# Altium project PlacasBeetle.PrjPcb
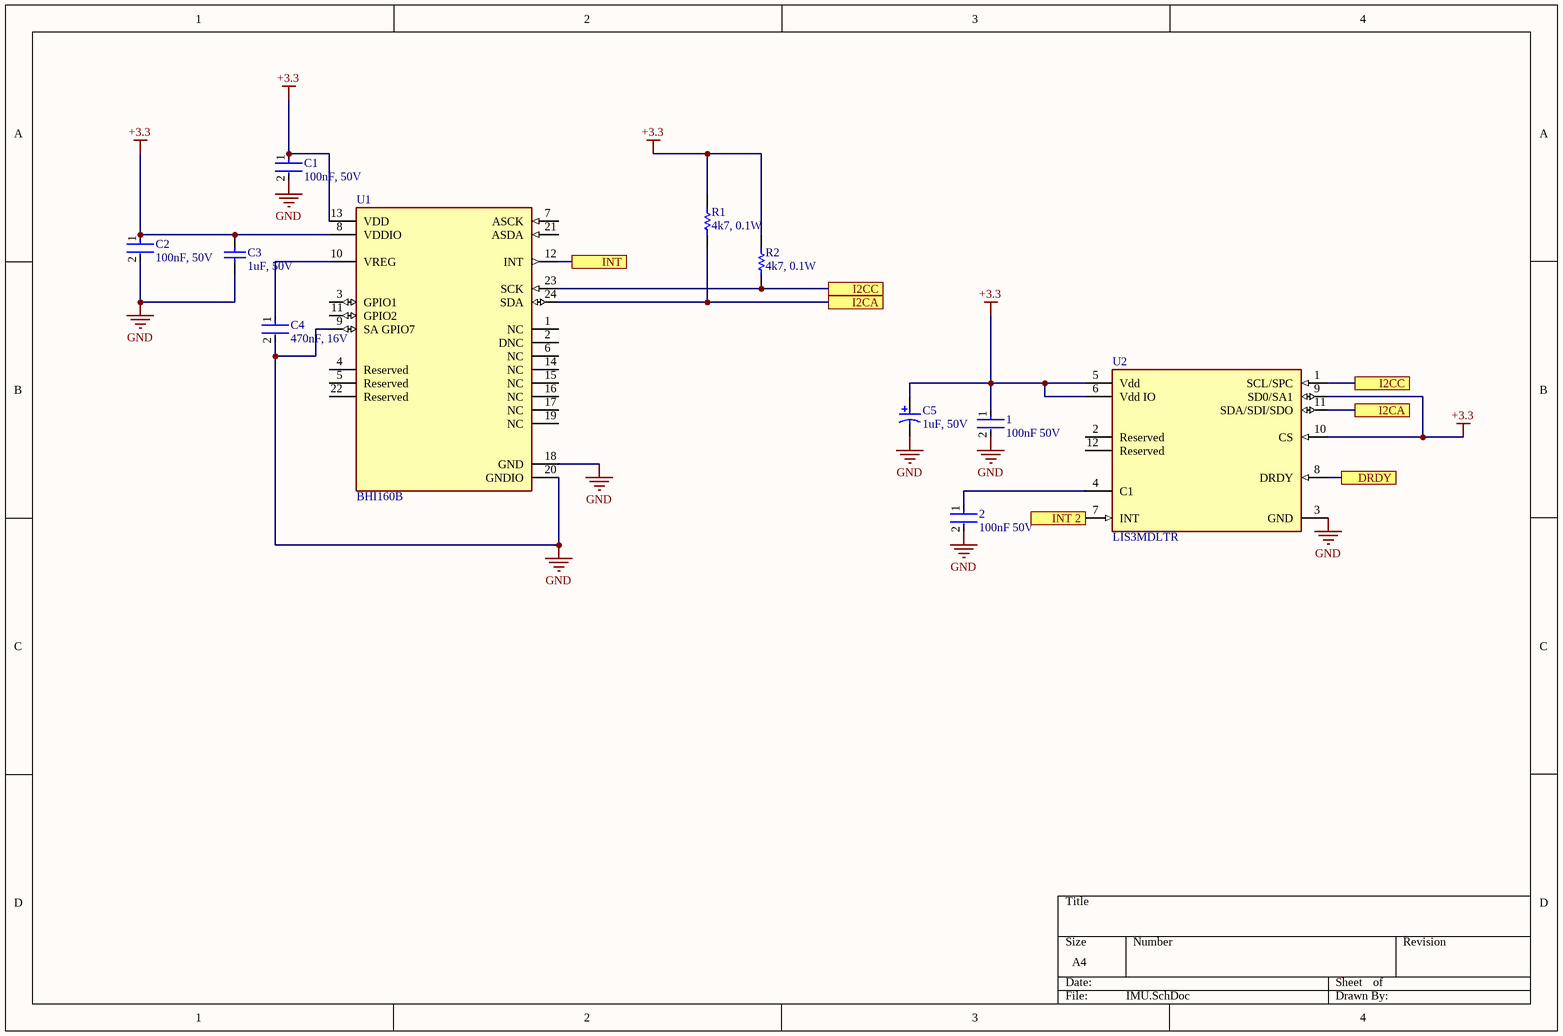
[diagram p0: IMU.SchDoc]
2 sheets, 32 parts. Net scope: flat (ports and power ports of the same name join across sheets).
Board file: PlacaMãe.PcbDoc
Sheets:
  IMU.SchDoc
  PlacaMãe_Raw.SchDoc

## Sheet IMU.SchDoc
size A4; SheetNumber: 1; SheetTotal: 2

### Parts
1  100nF 50V  [FP-CGA3E-0_3-0_1-IPC_A]
2  100nF 50V  [FP-CGA3E-0_3-0_1-IPC_A]
C1  100nF, 50V  [FP-CGA3E-0_3-0_1-IPC_A]
C2  100nF, 50V  [FP-CGA3E-0_3-0_1-IPC_A]
C3  1uF, 50V  [CAPC1608X90X35ML10T25]
C4  470nF, 16V  [FP-C0603C-CF-MFG]
C5  1uF, 50V  [CAPPR55-200-1100X500X1200]
R1  4k7, 0.1W  [RESC1608X55X25LL10T15]
R2  4k7, 0.1W  [RESC1608X55X25LL10T15]
U1  BHI160B  [FP-BHI160B-MFG]
U2  LIS3MDLTR  [FP-VFLGA-12-8365767-MFG]

### Ports
DRDY, I2CA, I2CC, INT, INT 2

### Nets
+3.3: 1.1 C1.1 C2.1 C3.2 C5.1 R1.2 R2.2 U1.8(VDDIO) U1.13(VDD) U2.5(Vdd) U2.6(Vdd_IO) U2.9(SD0/SA1) U2.10(CS)
GND: 1.2 2.2 C1.2 C2.2 C3.1 C4.2 C5.2 U1.9(SA_GPIO7) U1.18(GND) U1.20(GNDIO) U2.3(GND)
Net2_1: 2.1 U2.4(C1)
NetC4_1: C4.1 U1.10(VREG)
NetP1_15: R2.1 U1.23(SCK) U2.1(SCL/SPC) ; port I2CC
NetP1_16: R1.1 U1.24(SDA) U2.11(SDA/SDI/SDO) ; port I2CA
NetP2_2: U2.7(INT) ; port INT 2
NetP2_3: U2.8(DRDY) ; port DRDY
NetP2_11: U1.12(INT) ; port INT

Not connected (* = marked no-connect by the designer): U1 1(NC) 2(DNC) 3(GPIO1) 4(Reserved) 5(Reserved) 6(NC) 7(ASCK) 11(GPIO2) 14(NC) 15(NC) 16(NC) 17(NC) 19(NC) 21(ASDA) 22(Reserved); U2 2(Reserved) 12(Reserved)

### Library data of the parts
1 2 C1 C2 = CMP-2000-07546-2: Cap Ceramic 100nF 50V X7R 10% Pad SMD 0603 +125°C Automotive T/R; Weight: 7.1E-05oz; Composition: Ceramic; Max Operating Temperature: 125°C; Termination: SMD/SMT; Dielectric: X7R; Length: 1.6mm; Package Quantity: 1; REACH SVHC: No SVHC; Lead Free: Lead Free; Case Code (Metric): 1608; Min Operating Temperature: -55°C; Packaging: Tape and Reel; Tolerance: 10%; Voltage Rating: 50V; Case Code (Imperial): 0603; Capacitance: 100nF; Case/Package: 0603; Voltage Rating (DC): 50V; Depth: 0.8mm; Radiation Hardening: No; Ratings: AEC-Q200; Mount: Surface Mount; Voltage: 50V; Thickness: 0.035inch; Width: 0.8mm; Height: 0.8mm
C3 = CMP-2000-05447-1: Chip Capacitor, 1 uF, +/- 10%, 50 V, -55 to 85 degC, 0603 (1608 Metric), RoHS, Tape and Reel; Manufacturer: Taiyo Yuden; Other Names: 587-2400-6; Temperature Coefficient: X5R; Online Catalog: MSeries; Catalog Drawings: xMKSeries_0603_0.8; Capacitance: 1µF; Series: M; Standard Package: 1; Package Description: 2-Pin Surface Mount Device, Body 1.6 x 0.8 mm; Ratings: -; Height - Seated (Max): -; Mounting Type: SurfaceMount,MLCC; Family: CeramicCapacitors; Size / Dimension: 0.063"Lx0.031"W(1.60mmx0.80mm); Features: -; Applications: GeneralPurpose; Lead Spacing: -; Packaging: Digi-Reel; Package Reference: 603; Thickness (Max): 0.035"(0.90mm); Category: Capacitors; Operating Temperature: -55degC~85degC; Datasheet URL: https://datasheet.ciiva.com/15922/336umk107bj105ka-t-15922611.pdf; Package / Case: 0603(1608Metric); Manufacturer URL: http://www.t-yuden.com/; Lead Style: -; Tolerance: ±10%; Voltage - Rated: 50V; Datasheet Version: Mar-13
C4 = CMP-2006-03235-2: CAP CER 0.47UF 16V X7R 0603; Manufacturer Part Number: C0603C474K4RACTU; Manufacturer: KEMET; Automotive Grade: Grade 1; Value: 0.47 μF; Tolerance: 0.1; Temperature Coefficient: 30ppm/°C; Material: Ceramic; Device Class L3: Ceramic Capacitors; ComponentLink2URL: https://api.kemet.com/component-edge/download/datasheet/C0603C100J5GACAUTO.pdf; Height: 0.87mm; ComponentLink2Description: Datasheet; Device Class L2: Capacitors; Temperature Range Low: -55°C; Temperature Range High: +125°C; RoHS: TRUE; Mouser Description: 0603 C 470nF Ceramic Multilayer Capacitor, 16 V, +125degC, X7R Dielec, +/-10%; Temperature Characteristic: X7R; Digikey Description: CAP CER 0.47UF 16V X7R 0603; Lead Free: Yes; Automotive: Yes; Octopart: https://octopart.com/c0603c474k4ractu-kemet-109683; Capacitance: 0.47 μF; Package: C0603C-CF; Voltage Rating: 16 V; Device Class L1: Passive Components; Category: Cap; Temperature: -55°C to +125°C
C5 = CMP-1665-00039-1: Aluminum Electrolytic Capacitor, 1 uF, +/- 20%, 50 V, -55 to 105 degC, 2-Pin THD, RoHS, Bulk; Channels: 2; ComponentLink1Description: Manufacturer URL; ComponentLink2Description: Datasheet; ComponentLink2URL: https://datasheet.ciiva.com/7275/94060-7275472.pdf; PackageDescription: 2-Pin Radial Lead, Dia 5 mm, Body Length 11 mm; PackageReference: CAPPR55-200-1100X500X1200; Mount: Through Hole; Radiation Hardening: No; ComponentLink1URL: http://www.panasonic.com/; Min Operating Temperature: -30 degC; Package Quantity: 150; Max Operating Temperature: 70 degC; DatasheetVersion: Mar-05; RoHSCompliant: true; Packaging: Bulk
R1 R2 = CMP-2000-06942-1: Chip Resistor, 4.7 KOhm, +/- 1%, 0.1 W, -55 to 155 degC, 0603 (1608 Metric), RoHS, Tape and Reel; Manufacturer: Yageo; Power Rating: 100mW; Temperature Coefficient: 100PPM/C; Resistance: 4.7kOhms; Voltage Rating: 50V; Package Reference: 0603; Series: RC; Datasheet Version: Rev. 7, 05/2017; Packaging: Reel; Termination Style: SMD/SMT; Datasheet URL: http://www.yageo.com/documents/recent/PYu-RC_Group_51_RoHS_L_7.pdf; Manufacturer URL: http://www.yageo.com/; Package Description: 2-Pin Surface Mount Device, Body 1.6 x 0.8 mm; Case Code - mm: 1608; Case Code - in: 0603; Mounting Technology: SurfaceMount; Operating Temperature Range: -55Cto+155C; Tolerance: 1%; Product: ThickFilmResistorsGeneralPurpose
U1 = CMP-191067-000004-1: IMU ACCEL/GYRO 3-AXIS I2C 24LGA; Manufacturer: Bosch Sensortec; Accel Resolution: 16bits; Operating Supply Current: 300-800uA; Sensor Type: Temperature,Accelerometer,Gyroscope; Accel Range: 2/4/8/16g; Gyro Sensitivity: 16.4/32.8/65.6/131.2/262.4LSB/°/s; Min Supply Voltage: 1.6V; Gyro Range: 125/250/500/1000/2000°/s; Accel Sensitivity: 2048/4096/8192/16384LSB/g; Max Supply Voltage: 3.6V; Sensor Output: I2C; Lead Free: Yes; Temperature: -40°C to +85°C; Height: 1mm; Ambient Temperature Range High: +85°C; Manufacturer Part Number: BHI160B; Temperature Range Low: -40°C; Category: IC; Octopart: https://octopart.com/bhi160b-bosch+sensortec-108216126; ComponentLink2URL: https://ae-bst.resource.bosch.com/media/_tech/media/datasheets/BST-BHI160B-DS000.pdf; RoHS: TRUE; Ambient Temperature Range Low: -40°C; Digikey Description: IMU ACCEL/GYRO 3-AXIS I2C 24LGA; Device Class L1: Sensors; Temperature Range High: +85°C; ComponentLink2Description: Datasheet; Package: 0; Device Class L2: Motion Sensors; Device Class L3: Inertial Measurement Units (IMUs); Automotive: No; Resolution: 16bits
U2 = CMP-2000-07463-2: SENSOR MR I2C/SPI 12LGA; Manufacturer: STMicroelectronics; Sensor Output: I2C,SPI; Operating Supply Current: 40-270uA; Max Supply Voltage: 3.6V; Sensing Method: Magnetic; Min Supply Voltage: 1.71V; ComponentLink2URL: https://www.st.com/resource/en/datasheet/lis3mdl.pdf; Category: IC; Manufacturer Part Number: LIS3MDLTR; Octopart: https://octopart.com/lis3mdltr-stmicroelectronics-29403125; Automotive: No; ComponentLink2Description: Datasheet; RoHS: TRUE; Device Class L3: unset; Device Class L1: Sensors; Temperature: -40°C to +85°C; Height: 1mm; Mouser Description: Board Mount Hall Effect / Magnetic Sensors Ultra Lo-Pwr Hi Perf 3-Axis 1.9-3.6V; Temperature Range High: +85°C; Lead Free: Yes; Device Class L2: Magnetic Sensors; Footprint Url: https://www.st.com/content/ccc/resource/technical/document/technical_note/73/17/9c/16/dd/96/4a/01/CD00134799.pdf/files/CD00134799.pdf/jcr:content/translations/en.CD00134799.pdf; Temperature Range Low: -40°C; Package: VFLGA-12-8365767; Digikey Description: SENSOR MR I2C/SPI 12LGA

## Sheet PlacaMãe_Raw.SchDoc
size A4; SheetNumber: 2; SheetTotal: 2
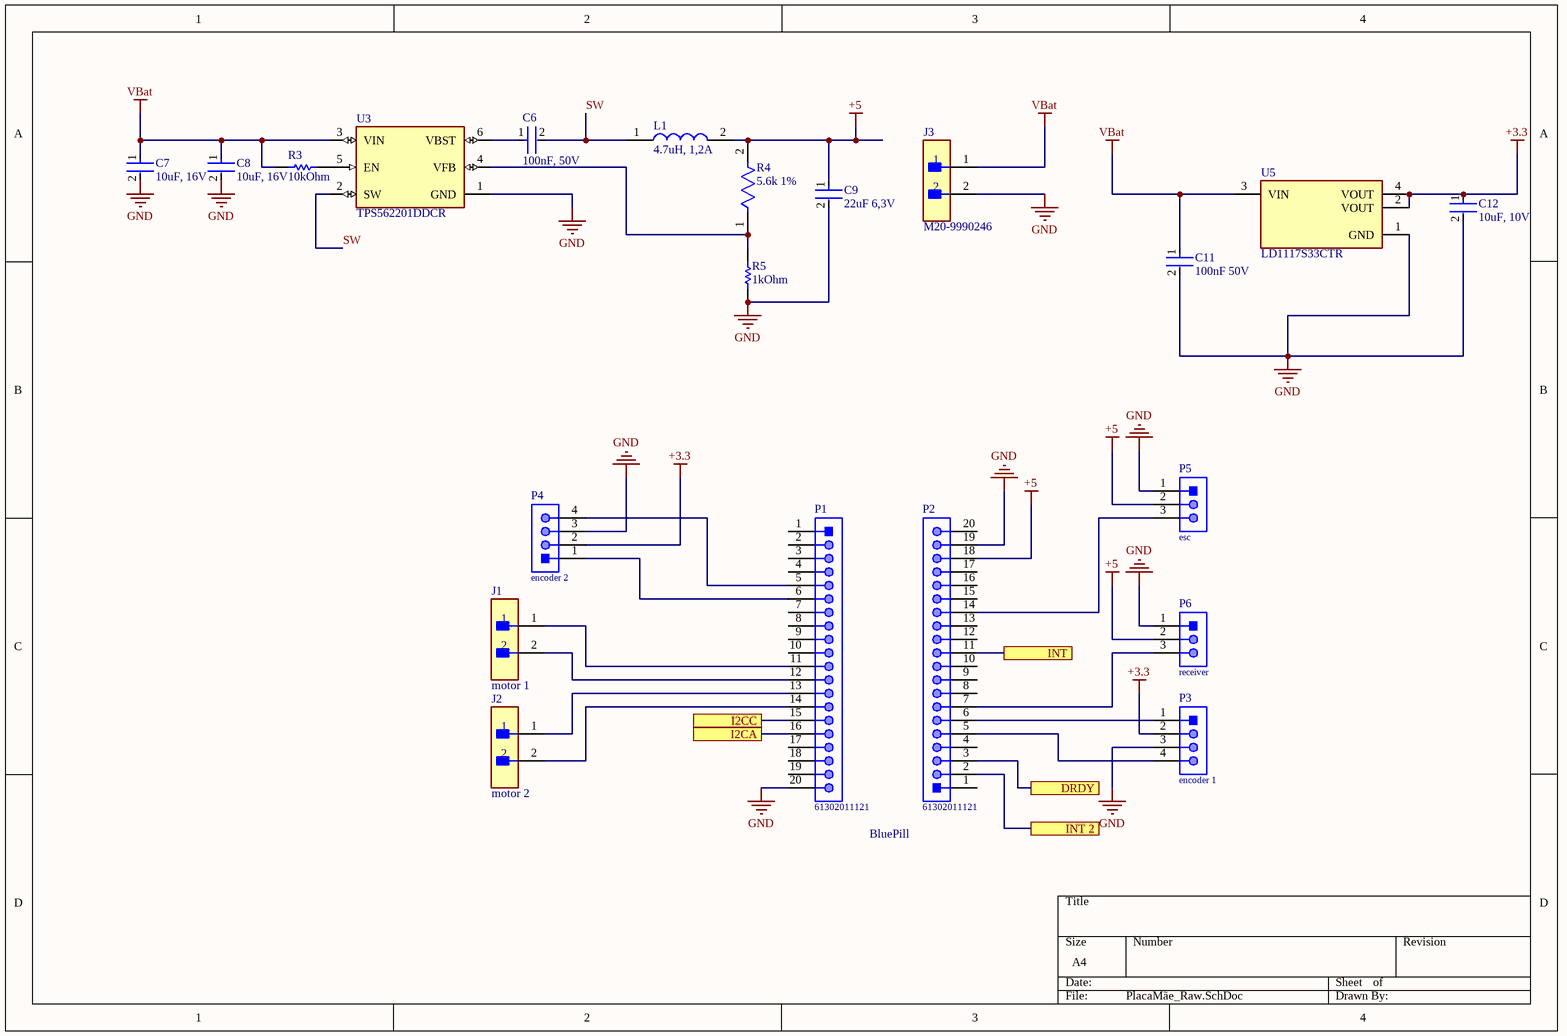
[diagram p1: PlacaMãe_Raw.SchDoc]

### Parts
C6  100nF, 50V  [FP-CGA3E-0_3-0_1-IPC_A]
C7  10uF, 16V  [FP-GRM21B-0_1-IPC_C]
C8  10uF, 16V  [FP-GRM21B-0_1-IPC_C]
C9  22uF 6,3V  [FP-GRM21B-0_15-MFG]
C11  100nF 50V  [FP-C0805C-DN-MFG]
C12  10uF, 10V  [FP-C1608-080-MFG]
J1  motor 1  [FP-M20-9990246-MFG]
J2  motor 2  [FP-M20-9990246-MFG]
J3  M20-9990246  [FP-M20-9990246-MFG]
L1  4.7uH, 1,2A  [CDRH2D09NP4R7MC]
P1  61302011121  [61302011121]
P2  61302011121  [61302011121]
P3  encoder 1  [61300411121]
P4  encoder 2  [61300411121]
P5  esc  [61300311121]
P6  receiver  [61300311121]
R3  10kOhm  [RESC1609X55X30LL15T15]
R4  5.6k 1%  [FP-CRCW0805-e3-IPC_A]
R5  1kOhm  [RESC1608X55X30ML20T20]
U3  TPS562201DDCR  [FP-DDC0006A-IPC_A]
U5  LD1117S33CTR  [FP-SOT-223-0046067_14-MFG]

### Ports
DRDY, I2CA, I2CC, INT, INT 2

### Nets
+3.3: C12.1 P3.2 P4.2 U5.2(VOUT) U5.4(VOUT)
+5: C9.1 L1.2 P2.18 P5.2 P6.2 R4.2
GND: C7.2 C8.2 C9.2 C11.2 C12.2 J3.2 P1.20 P2.19 P3.3 P4.3 P5.1 P6.1 R5.1 U3.1(GND) U5.1(GND)
VBat: C7.1 C8.1 C11.1 J3.1 R3.1 U3.3(VIN) U5.3(VIN)
SW: C6.2 L1.1 U3.2(SW)
NetC6_1: C6.1 U3.6(VBST)
NetJ1_1: J1.1 P1.11
NetJ1_2: J1.2 P1.12
NetJ2_1: J2.1 P1.13
NetJ2_2: J2.2 P1.14
NetP1_5: P1.5 P4.4
NetP1_6: P1.6 P4.1
NetP1_15: P1.15 ; port I2CC
NetP1_16: P1.16 ; port I2CA
NetP2_2: P2.2 ; port INT 2
NetP2_3: P2.3 ; port DRDY
NetP2_5: P2.5 P3.4
NetP2_6: P2.6 P3.1
NetP2_7: P2.7 P6.3
NetP2_11: P2.11 ; port INT
NetP2_14: P2.14 P5.3
NetR3_2: R3.2 U3.5(EN)
NetR4_1: R4.1 R5.2 U3.4(VFB)

Not connected (* = marked no-connect by the designer): P1 1 2 3 4 7 8 9 10 17 18 19; P2 1 4 8 9 10 12 13 15 16 17 20

### Notes on the sheet
- BluePill

### Library data of the parts
C6 = CMP-2000-07546-2: as 1 on sheet IMU; Weight: 7.1E-05oz; Composition: Ceramic; Max Operating Temperature: 125°C; Termination: SMD/SMT; Dielectric: X7R; Length: 1.6mm; Package Quantity: 1; REACH SVHC: No SVHC; Lead Free: Lead Free; Case Code (Metric): 1608; Min Operating Temperature: -55°C; Packaging: Tape and Reel; Tolerance: 10%; Voltage Rating: 50V; Case Code (Imperial): 0603; Capacitance: 100nF; Case/Package: 0603; Voltage Rating (DC): 50V; Depth: 0.8mm; Radiation Hardening: No; Ratings: AEC-Q200; Mount: Surface Mount; Voltage: 50V; Thickness: 0.035inch; Width: 0.8mm; Height: 0.8mm
C7 C8 = CMP-2007-03453-2: Chip Multilayer Ceramic Capacitors for General Purpose, 0805, 10uF, X5R, 15%, 10%, 16V; Radiation Hardening: No; Thickness: 0.053inch; Voltage Rating (DC): 16V; Lead Free: Lead Free; Package Quantity: 1; Width: 1.25mm; Case Code (Imperial): 0805; Depth: 1.25mm; Packaging: Tape and Reel; Dielectric: X5R; Max Operating Temperature: 85°C; Tolerance: 10%; Voltage Rating: 16V; Voltage: 16V; Capacitance: 10uF; Height: 1.25mm; Case Code (Metric): 2012; Material: Ceramic; Mount: Surface Mount; Case/Package: 0805; REACH SVHC: No SVHC; Length: 2mm; Min Operating Temperature: -55°C; Termination: SMD/SMT
C9 = CMP-2007-03385-2: Chip Multilayer Ceramic Capacitors for General Purpose, 0805, 22uF, X5R, 15%, 20%, 6.3V; Material: Ceramic; Max Operating Temperature: 85°C; Voltage: 6.3V; Min Operating Temperature: -55°C; Case/Package: 0805; Thickness: 0.053inch; Dielectric: X5R; Packaging: Tape and Reel; Depth: 1.25mm; Termination: SMD/SMT; Voltage Rating (DC): 6.3V; Radiation Hardening: No; Tolerance: 20%; Mount: Surface Mount; Lead Free: Lead Free; Package Quantity: 1; REACH SVHC: No SVHC; Voltage Rating: 6.3V; Capacitance: 22uF; Length: 2mm; Case Code (Imperial): 0805; Case Code (Metric): 2012; Width: 0.049inch; Height: 1.25mm
C11 = CMP-2007-00279-2: CAP CER 0.1UF 50V X7R 0805; Manufacturer Part Number: C0805C104K5RACTU; Manufacturer: KEMET; Value: 0.10 μF; Tolerance: 0.1; Temperature Coefficient: 30ppm/°C; Material: Ceramic; Device Class L2: Capacitors; Temperature Range Low: -55°C; Voltage Rating: 50 V; Digikey Description: CAP CER 0.1UF 50V X7R 0805; Category: Cap; ComponentLink2Description: Datasheet; Octopart: https://octopart.com/c0805c104k5ractu-kemet-143926; RoHS: TRUE; ComponentLink2URL: https://content.kemet.com/datasheets/KEM_C1003_C0G_SMD.pdf; Temperature Characteristic: X7R; Temperature: -55°C to +125°C; Height: 0.88mm; Temperature Range High: +125°C; Device Class L1: Passive Components; Automotive: No; Lead Free: Yes; Ipc Land Pattern Name: CAPC200125X78; Device Class L3: Ceramic Capacitors; Mouser Description: Cap Ceramic 0.1uF 50V X7R 10% SMD 2.0 x 1.2 mm 125 C Paper T/R; Capacitance: 0.10 μF; Package: C0805C-DN
C12 = CMP-2000-04979-2: CAP CER 10UF 10V X5R 0603; Manufacturer Part Number: C1608X5R1A106K080AC; Manufacturer: TDK; Temperature Coefficient: 15%; Tolerance: 10%; Material: Ceramic; Mouser Description: CAP CER 10UF 10V X5R 0603; Package: C1608-080; Lead Free: Yes; Device Class L1: Passive Components; Value: 10uF; Temperature Range High: +85°C; Octopart: https://octopart.com/c1608x5r1a106k080ac-tdk-26013468; Voltage: 10V; Footprint Url: https://product.tdk.com/info/en/catalog/spec/mlccspec_commercial_general_midvoltage_en.pdf; Ipc Land Pattern Name: CAPC16080X80; Temperature Range Low: -55°C; Temperature: -55°C to +85°C; ComponentLink2Description: Datasheet; ComponentLink2URL: https://product.tdk.com/info/en/documents/chara_sheet/C1608X5R1A106K080AC.pdf; Height: 0.9mm; Temperature Characteristic: X5R; RoHS: TRUE; Category: Cap; Capacitance: 10uF; Digikey Description: CAP CER 10UF 10V X5R 0603; Automotive: No; Device Class L3: Ceramic Capacitors; Device Class L2: Capacitors; Voltage Rating: 10V
J1 J2 = CMP-15831-000009-1: CONN HEADER VERT 2POS 2.54MM; Manufacturer: Harwin; Manufacturer Part Number: M20-9990246; Conn Gender: Male; Conn Orientation: Vertical; Number Of Contacts: 2; Current Rating: 3A; ComponentLink2URL: https://cdn.harwin.com/pdfs/M20-999.pdf; ComponentLink2Description: Datasheet; Package: M20-9990246; Temperature: -40°C to +105°C; Octopart: https://octopart.com/m20-9990246-harwin-2590635; Mouser Description: 2.54mm (0.1") Pitch SIL Vertical PC Tail Pin Header, 6.1mm mating pin height, tin, 2 contacts; Temperature Range High: +105°C; Device Class L1: Connectors; RoHS: TRUE; Automotive: No; Height: 8.99mm; Number Of Rows: 1; Contact Material: Tin,Nickel; Category: Conn; Pitch: 2.54mm; Lead Free: Yes; Digikey Description: CONN HEADER VERT 2POS 2.54MM; Temperature Range Low: -40°C; Device Class L3: unset; Device Class L2: Headers and Wire Housings
J3 = CMP-15831-000009-1: CONN HEADER VERT 2POS 2.54MM; Manufacturer: Harwin; Conn Gender: Male; Conn Orientation: Vertical; Number Of Contacts: 2; Current Rating: 3A; ComponentLink2URL: https://cdn.harwin.com/pdfs/M20-999.pdf; ComponentLink2Description: Datasheet; Package: M20-9990246; Temperature: -40°C to +105°C; Octopart: https://octopart.com/m20-9990246-harwin-2590635; Mouser Description: 2.54mm (0.1") Pitch SIL Vertical PC Tail Pin Header, 6.1mm mating pin height, tin, 2 contacts; Temperature Range High: +105°C; Device Class L1: Connectors; RoHS: TRUE; Automotive: No; Height: 8.99mm; Number Of Rows: 1; Contact Material: Tin,Nickel; Category: Conn; Pitch: 2.54mm; Lead Free: Yes; Digikey Description: CONN HEADER VERT 2POS 2.54MM; Manufacturer Part Number: M20-9990246; Temperature Range Low: -40°C; Device Class L3: unset; Device Class L2: Headers and Wire Housings
L1 = CDRH2D18_HPNP-4R7NC: Inductor; Manufacturer_Name: Sumida; Manufacturer_Part_Number: CDRH2D18/HPNP-4R7NC; Datasheet Link: https://products.sumida.com/products/pdf/CDRH2D18HP.pdf; Height: 1mm; Mouser Part Number: 851-CDRH2D18HP-4R7NC; Mouser Price/Stock: https://www.mouser.co.uk/ProductDetail/Sumida/CDRH2D18-HPNP-4R7NC?qs=%2Fk4tzQy0az%2FNmO92%2F%252BEfMw%3D%3D; Arrow Part Number: CDRH2D18/HPNP-4R7NC; Arrow Price/Stock: https://www.arrow.com/en/products/cdrh2d18hpnp-4r7nc/sumida
P1 P2 = CMP-1502-01102-1: THT Vertical Pin Header WR-PHD, Pitch 2.54 mm, Single Row, 20 pins; Manufacturer: Wurth Elektronik; Withstanding Voltage: 500VAC; Gender: Male; Pin Number: 20; Rated Current: 3A; Contact Resistance: 20mOhm; Pitch: 2.54mm; Working Voltage: 250VAC; Publisher: WurthElektronik; Packaging: Bag; Datasheet URL: https://katalog.we-online.de/em/datasheet/6130xx11121.pdf; Row Number: Single; Mounting Technology: THT; Manufacturer URL: http://www.we-online.de; Orientation: Vertical; Package Reference: 61302011121; Part Number: 61302011121; Operating Temperature: -40to105degC
P3 P4 = CMP-1502-01064-1: THT Vertical Pin Header WR-PHD, Pitch 2.54 mm, Single Row, 4 pins; Manufacturer: Wurth Elektronik; Withstanding Voltage: 500VAC; Rated Current: 3A; Working Voltage: 250VAC; Pin Number: 4; Gender: Male; Contact Resistance: 20mOhm; Pitch: 2.54mm; Manufacturer URL: http://www.we-online.de; Operating Temperature: -40to105degC; Packaging: Bag; Mounting Technology: THT; Package Reference: 61300411121; Datasheet URL: https://katalog.we-online.de/em/datasheet/6130xx11121.pdf; Publisher: WurthElektronik; Part Number: 61300411121; Row Number: Single; Orientation: Vertical
P5 P6 = CMP-1502-01062-1: THT Vertical Pin Header WR-PHD, Pitch 2.54 mm, Single Row, 3 pins; Manufacturer: Wurth Elektronik; Withstanding Voltage: 500VAC; Working Voltage: 250VAC; Rated Current: 3A; Pitch: 2.54mm; Pin Number: 3; Gender: Male; Contact Resistance: 20mOhm; Package Reference: 61300311121; Manufacturer URL: http://www.we-online.de; Datasheet URL: https://katalog.we-online.de/em/datasheet/6130xx11121.pdf; Operating Temperature: -40to105degC; Part Number: 61300311121; Orientation: Vertical; Packaging: Bag; Row Number: Single; Mounting Technology: THT; Publisher: WurthElektronik
R3 = CMP-1012-00623-3: Chip Resistor, 10 KOhm, +/- 1%, 0.1 W, -55 to 155 degC, 0603 (1608 Metric), RoHS, Tape and Reel; Manufacturer: Panasonic; Voltage Rating: 75V; Case\/Package: 0603; Power Rating: 100mW; Temperature Coefficient: 100ppm\/degreesC; Number of Pins: 2; Package Reference: 603; Depth: 0.8mm; Mount: SurfaceMount; Package Description: 2-Pin Surface Mount Device, Body 1.6 x 0.85 mm; Datasheet Version: 02/2017; Resistance: 10KOhm; Length: 1.6mm; Lead Free: LeadFree; Height: 0.45mm; Number of Terminations: 2; Max Power Dissipation: 100mW; Min Operating Temperature: -55degC; Datasheet URL: https://industrial.panasonic.com/cdbs/www-data/pdf/RDA0000/AOA0000C304.pdf; Termination: SMD/SMT; Case Code (Metric): 1608; Case Code (Imperial): 0603; Tolerance: 1%; Max Operating Temperature: 155degC; RoHSCompliant: true; Voltage Rating (DC): 75V; Radiation Hardening: No; Packaging: TapeandReel; Composition: ThickFilm; Mounting Technology: SurfaceMount; Manufacturer URL: http://www.panasonic.com/; Width: 0.031inch; REACH SVHC: NoSVHC; Contact Plating: Tin; Military Standard: Not; Package Quantity: 1
R4 = CMP-2001-04030-2: RES Thick Film, 5.6kΩ, 1%, 0.125W, 100ppm/°C, 0805; Resistance: 5.6kR; Voltage Rating: 150V; Max Power Dissipation: 125mW; Case Code (Imperial): 0805; Features: Automotive AEC-Q200; Composition: Thick Film; Package Quantity: 1; Mount: Surface Mount; Tolerance: 1%; Radiation Hardening: No; Length: 2mm; Case Code (Metric): 2012; Temperature Coefficient: 100ppm/°C; Power Rating: 125mW; Number of Terminations: 2; Lead Free: Lead Free; Voltage Rating (DC): 150V; Military Standard: Not; Number of Pins: 2; Height: 0.45mm; Depth: 1.25mm; Weight: 0.000194oz; Packaging: Tape and Reel; Case/Package: 0805; Contact Plating: Tin; Min Operating Temperature: -55°C; Termination: SMD/SMT; Max Operating Temperature: 155°C; Width: 1.25mm
R5 = CMP-2000-00874-1: Part Number: ERA-3AEB103V; Manufacturer: Panasonic
U3 = CMP-04918-000361-1: IC REG BUCK ADJ 2A TSOT23-6; Switching Frequency: 580kHz; Max Input Voltage: 17V; Number of Outputs: 1; Output Voltage: 7V; Output Type: Adjustable; Quiescent Current: 400uA; Min Input Voltage: 4.5V; Mount: Surface Mount; Max Operating Temperature: 125°C; Lead Free: Lead Free; Operating Supply Voltage: 17V; Number of Pins: 6; RoHS Compliant: Yes; Contact Plating: Tin; Min Operating Temperature: -40°C; Case/Package: SOT; Max Output Current: 2A
U5 = CMP-0244-00307-2: IC REG LINEAR 3.3V 800MA SOT223; Input Bias Current: 5mA; Output Voltage Accuracy: 1%; Dropout Voltage: 1.1V; Power Dissipation: 12W; Polarity: Positive; Min Input Voltage: 5.3V; Quiescent Current: 10mA; Max Output Current: 1.3A; Output Current: 950mA; Number of Regulators: 1; Max Supply Voltage: 15V; Output Type: Fixed; Output Voltage: 3.3V; Number of Terminals: 4; Min Supply Voltage: 3.3V; Termination: SMD/SMT; Mount: Surface Mount; Max Power Dissipation: 12W; Case/Package: SOT-223; Lead Free: Lead Free; Height: 1.8mm; REACH SVHC: No SVHC; Radiation Hardening: No; Width: 3.5mm; Length: 6.5mm; Packaging: Tape and Reel; Max Input Voltage: 15V; Accuracy: 1%; Weight: 0.01lb; Contact Plating: Tin; Max Operating Temperature: 125°C; Number of Pins: 4; Max Output Voltage: 3.3V; Min Operating Temperature: -40°C; Nominal Output Voltage: 3.3V; Package Quantity: 1; Min Output Voltage: 3.3V; Number of Outputs: 1

## Nets that join several sheets
+3.3: IMU (13 pins), PlacaMãe_Raw (5 pins)
GND: IMU (11 pins), PlacaMãe_Raw (15 pins)
NetP1_15: IMU (R2.1 U1.23 U2.1), PlacaMãe_Raw (P1.15)
NetP1_16: IMU (R1.1 U1.24 U2.11), PlacaMãe_Raw (P1.16)
NetP2_2: IMU (U2.7), PlacaMãe_Raw (P2.2)
NetP2_3: IMU (U2.8), PlacaMãe_Raw (P2.3)
NetP2_11: IMU (U1.12), PlacaMãe_Raw (P2.11)